# EAGLE design utophuile_shield_v0_2 (EAGLE 5.07)
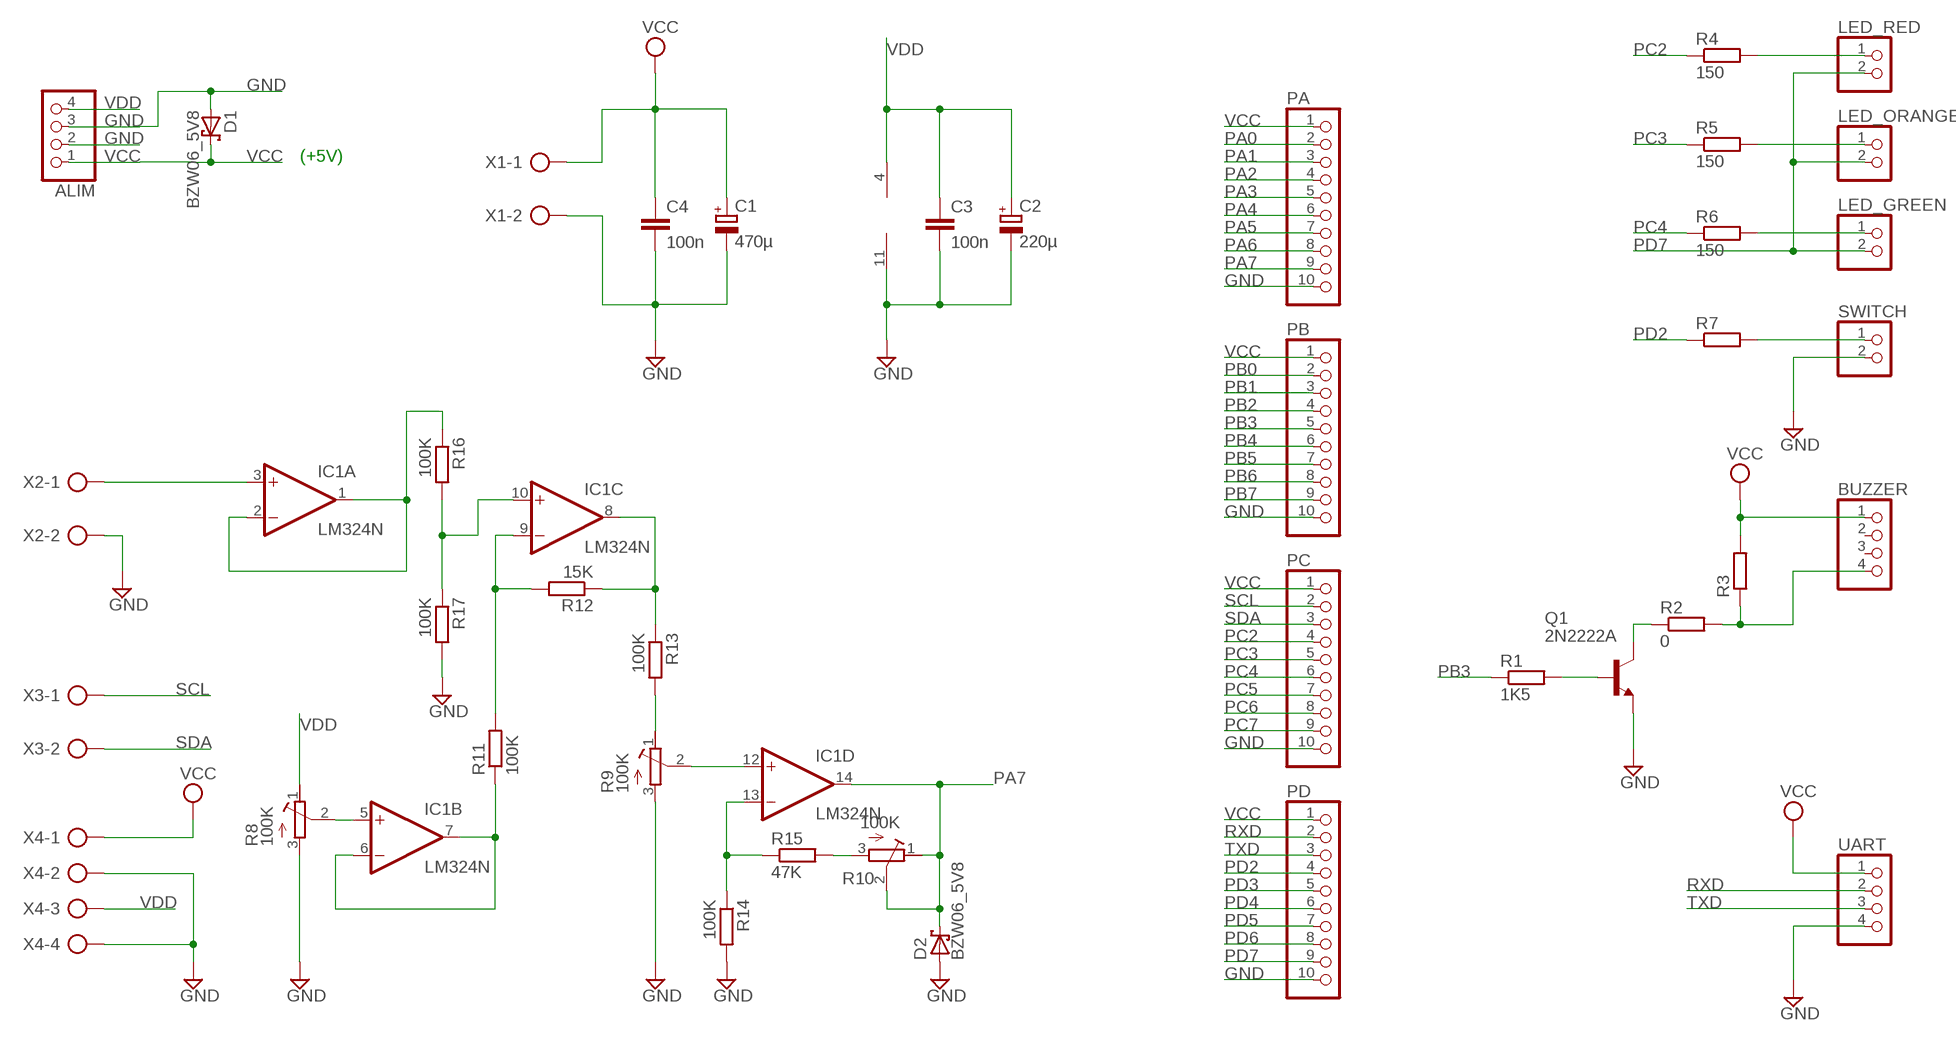
[diagram p0: schematic, sheet 1]

## Parts
ALIM  PINHD-1X4  [1X04]
BUZZER  PINHD-1X4_2.54-90°  [1X04/90]
C1  470µ  CPOL-EUE3.5-10  [E3,5-10]
C2  220µ  CPOL-EUE3.5-10  [E3,5-10]
C3  100n  C-EU050-025X075  [C050-025X075]
C4  100n  C-EU050-025X075  [C050-025X075]
D1  BZW06_5V8  BZW04XX  [F126Z12]
D2  BZW06_5V8  BZW04XX  [F126Z12]
IC1  LM324N  [DIL14]
LED_GREEN  PINHD-1X2_2.54-90°  [1X02/90]
LED_ORANGE  PINHD-1X2_2.54-90°  [1X02/90]
LED_RED  PINHD-1X2_2.54-90°  [1X02/90]
PA  PINHD-1X10  [1X10]
PB  PINHD-1X10  [1X10]
PC  PINHD-1X10  [1X10]
PD  PINHD-1X10  [1X10]
Q1  2N2222A  [TO18]
R1  1K5  R-EU_0207/10  [0207/10]
R2  0  R-EU_0207/10  [0207/10]
R3  R-EU_0207/10  [0207/10]
R4  150  R-EU_0207/10  [0207/10]
R5  150  R-EU_0207/10  [0207/10]
R6  150  R-EU_0207/10  [0207/10]
R7  R-EU_0207/10  [0207/10]
R8  100K  R-TRIMMT93YB  [RTRIMT93YB]
R9  100K  R-TRIMMT93YB  [RTRIMT93YB]
R10  100K  R-TRIMMT93YB  [RTRIMT93YB]
R11  100K  R-EU_0207/10  [0207/10]
R12  15K  R-EU_0207/10  [0207/10]
R13  100K  R-EU_0207/10  [0207/10]
R14  100K  R-EU_0207/10  [0207/10]
R15  47K  R-EU_0207/10  [0207/10]
R16  100K  R-EU_0207/10  [0207/10]
R17  100K  R-EU_0207/10  [0207/10]
SWITCH  PINHD-1X2_2.54-90°  [1X02/90]
UART  PINHD-1X4_2.54-90°  [1X04/90]
X1  AK500/2  [AK500/2]
X2  AK500/2  [AK500/2]
X3  AK500/2  [AK500/2]
X4  AK500/4  [AK500/4]

## Nets
GND: ALIM.2 ALIM.3 C1.- C2.- C3.2 C4.2 D1.A D2.A IC1.11(P:V-) PA.10 PB.10 PC.10 PD.10 Q1.1(E) R8.3(E) R9.3(E) R14.2 R17.2 SWITCH.2 UART.4 X1.2 X2.2 X4.2 X4.4
N$1: IC1.3(A:+IN) X2.1
N$2: R7.2 SWITCH.1
N$3: LED_GREEN.1 R6.2
N$4: LED_ORANGE.1 R5.2
N$5: LED_RED.1 R4.2
N$6: IC1.6(B:-IN) IC1.7(B:OUT) R11.1
N$7: BUZZER.4 R2.2 R3.1
N$8: Q1.3(C) R2.1
N$9: IC1.5(B:+IN) R8.2(S)
N$10: Q1.2(B) R1.2
N$11: IC1.9(C:-IN) R11.2 R12.2
N$12: IC1.8(C:OUT) R12.1 R13.1
N$13: R9.1(A) R13.2
N$14: IC1.12(D:+IN) R9.2(S)
N$15: IC1.13(D:-IN) R14.1 R15.1
N$16: R10.3(E) R15.2
N$17: IC1.10(C:+IN) R16.2 R17.1
N$18: IC1.1(A:OUT) IC1.2(A:-IN) R16.1
PA0: PA.2
PA1: PA.3
PA2: PA.4
PA3: PA.5
PA4: PA.6
PA5: PA.7
PA6: PA.8
PA7: D2.C IC1.14(D:OUT) PA.9 R10.1(A) R10.2(S)
PB0: PB.2
PB1: PB.3
PB2: PB.4
PB3: PB.5 R1.1
PB4: PB.6
PB5: PB.7
PB6: PB.8
PB7: PB.9
PC2: PC.4 R4.1
PC3: PC.5 R5.1
PC4: PC.6 R6.1
PC5: PC.7
PC6: PC.8
PC7: PC.9
PD2: PD.4 R7.1
PD3: PD.5
PD4: PD.6
PD5: PD.7
PD6: PD.8
PD7: LED_GREEN.2 LED_ORANGE.2 LED_RED.2 PD.9
RXD: PD.2 UART.2
SCL: PC.2 X3.1
SDA: PC.3 X3.2
TXD: PD.3 UART.3
VCC: ALIM.1 BUZZER.1 C1.+ C4.1 D1.C PA.1 PB.1 PC.1 PD.1 R3.2 UART.1 X1.1 X4.1
VDD: ALIM.4 C2.+ C3.1 IC1.4(P:V+) R8.1(A) X4.3
Unconnected: BUZZER.2 BUZZER.3

## Notes on the sheet
- (+5V)

## Library data of the parts
ALIM = pinhead:PINHD-1X4: PIN HEADER
BUZZER UART = pinhead-1:PINHD-1X4: PIN HEADER
C1 C2 = rcl:CPOL-EU: POLARIZED CAPACITOR, European symbol
C3 C4 = rcl:C-EU: CAPACITOR, European symbol
D1 D2 = diode:BZW04XX: DIODE
IC1 = linear:LM324: OP AMP
LED_GREEN LED_ORANGE LED_RED SWITCH = pinhead-1:PINHD-1X2: PIN HEADER
PA PB PC PD = pinhead:PINHD-1X10: PIN HEADER
Q1 = transistor-npn:2N2222*: NPN Transistor
R1-R7 R11-R17 = rcl:R-EU_: RESISTOR, European symbol
R8-R10 = rcl:R-TRIMM: Trimm resistor
X1-X3 = con-ptr500:AK500/2: CONNECTOR
X4 = con-ptr500:AK500/4: CONNECTOR

## Board
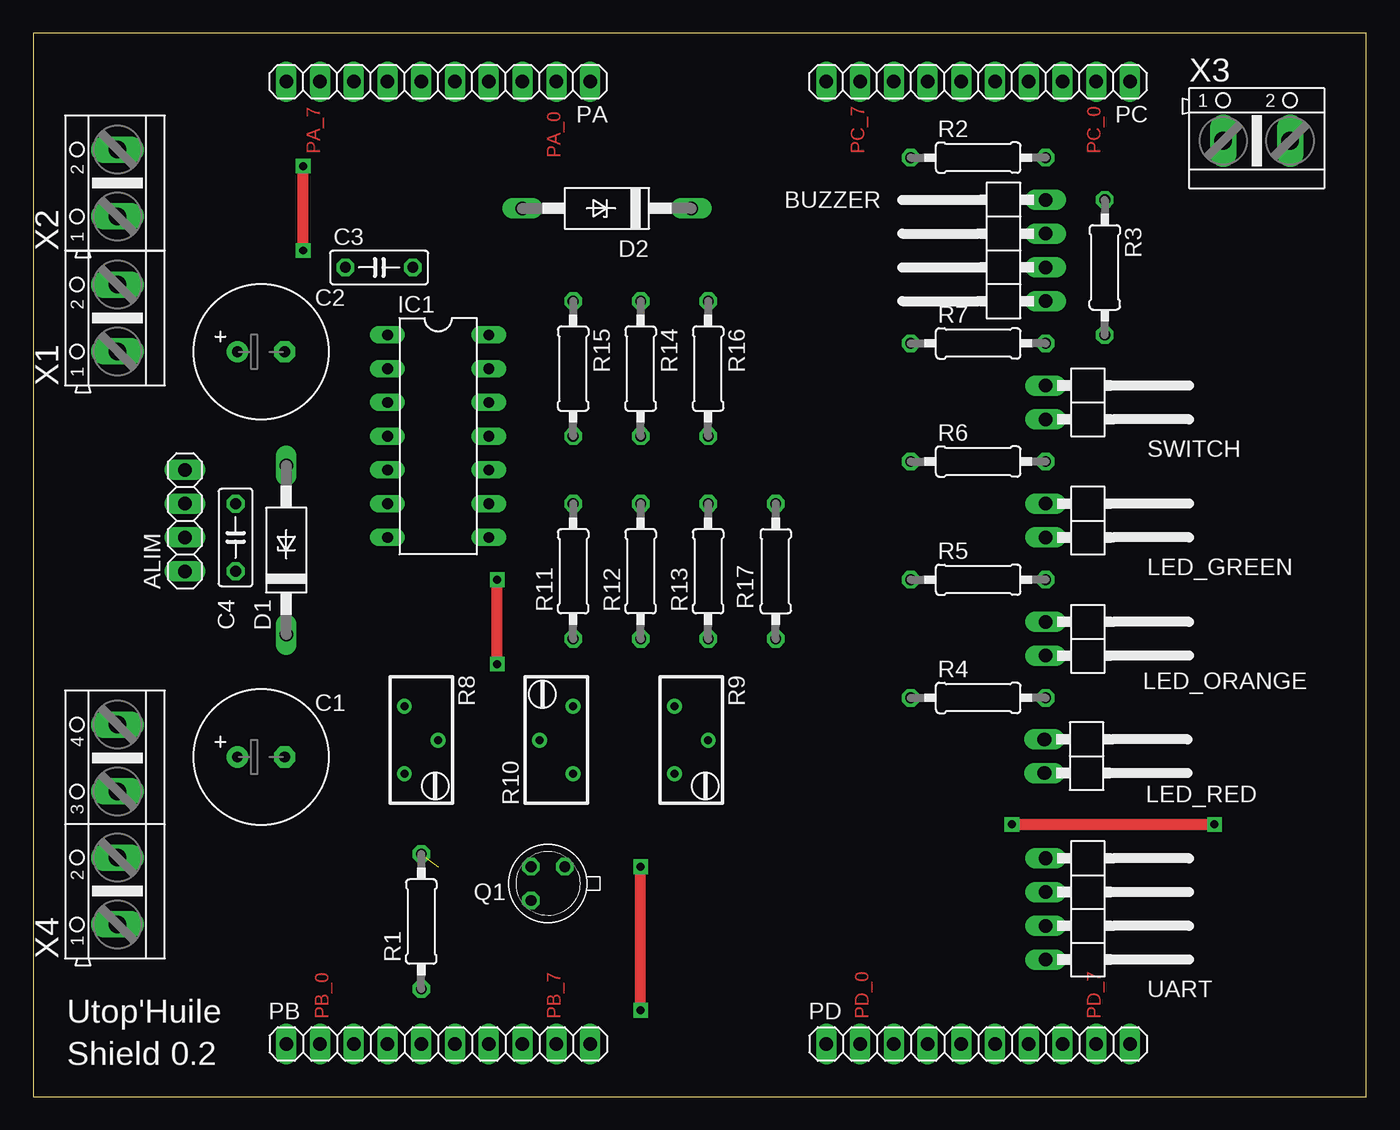
[diagram p1: board, top side]
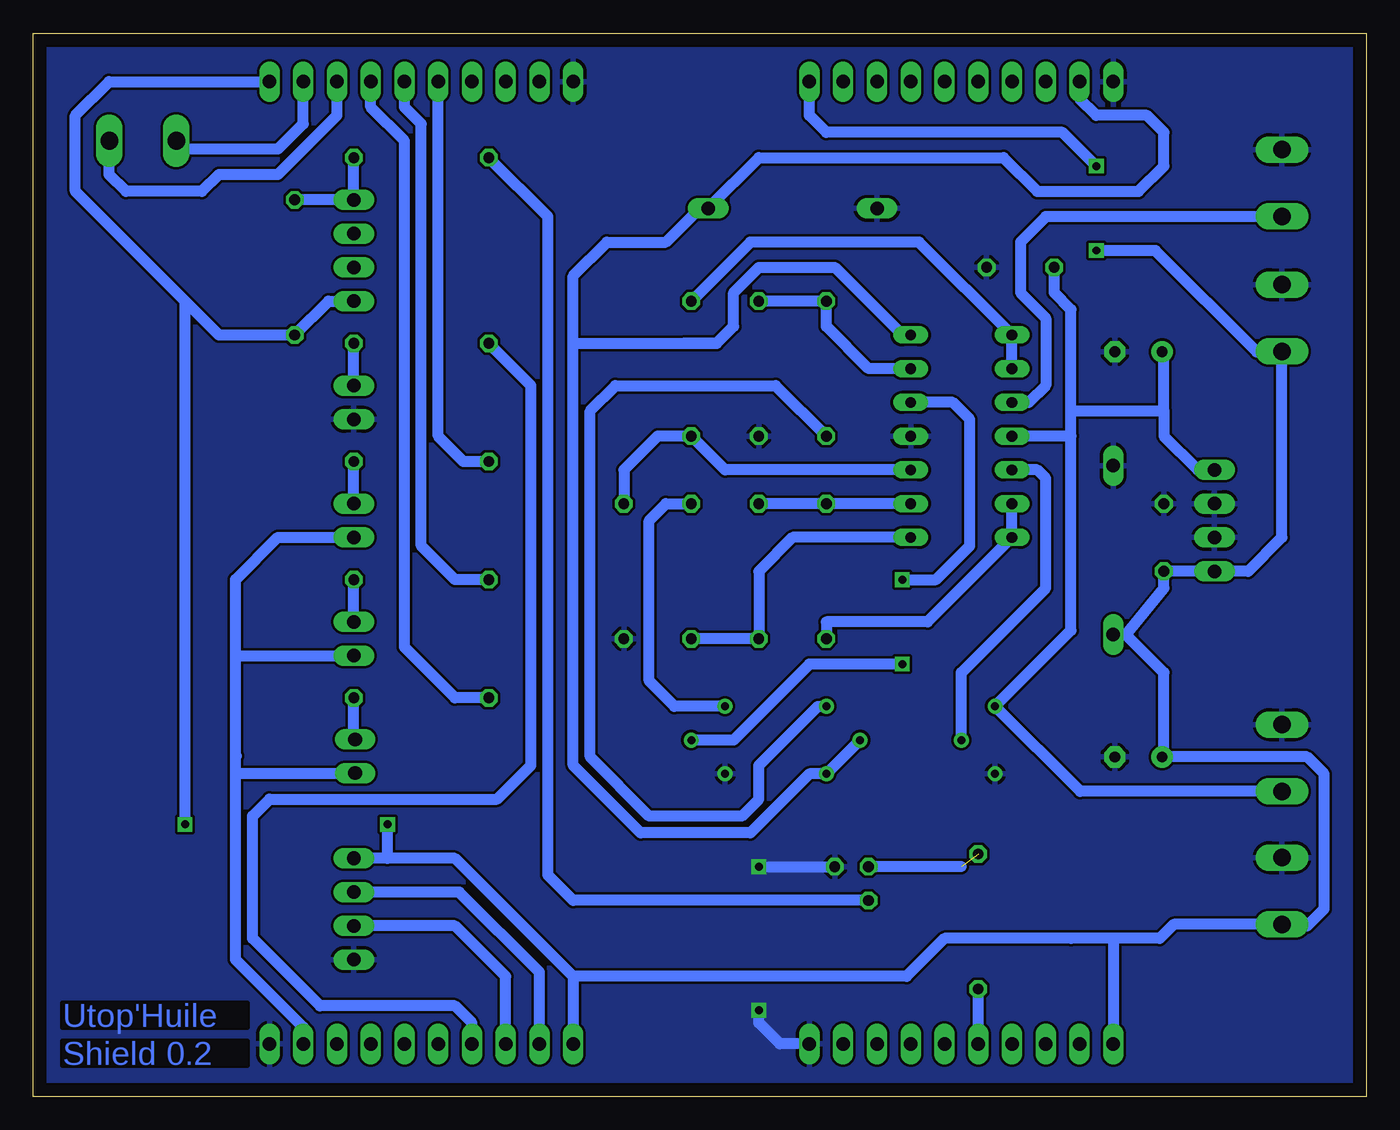
[diagram p2: board, bottom side, seen from below]

Size 100.32 x 80 mm. Coordinates in mm from the lower left corner, seen from the top.
Outline: 100.32,0 100.32,80 0,80 0,0 100.32,0
Copper layers (1*16): Top 0.035mm / dielectric 1.5mm / Bottom 0.035mm
Design rules "default *": minimum track width 10mil, minimum drill 24mil, track to track 8mil, track to pad 8mil, pad to pad 8mil, via to via 8mil, smd to smd 8mil, copper to edge 40mil, drill to drill 8mil, minimum pad ring 10mil, minimum via ring 10mil, stop-mask expansion 4mil, vias tented up to drill 0mil, thermal gap 10mil
Milling: 8 lines

### Footprints (pad centres in the part's own frame; a part is rotated, then mirrored left to right if it is on the bottom)
1X04 = drill 1.016 long: 1 -3.81,0; 2 -1.27,0; 3 1.27,0; 4 3.81,0
1X04/90 = drill 1.016 long: 1 -3.81,-3.81; 2 -1.27,-3.81; 3 1.27,-3.81; 4 3.81,-3.81
E3,5-10 = drill 0.813 pad 1.6 round: + -1.778,0 | drill 0.813 pad 1.6 octagon: - 1.778,0
C050-025X075 = drill 0.813 octagon: 1 -2.54,0; 2 2.54,0
F126Z12 = drill 1.016 long: A 6.35,0; C -6.35,0
DIL14 = drill 0.813 long: 1 -7.62,-3.81; 2 -5.08,-3.81; 3 -2.54,-3.81; 4 0,-3.81; 5 2.54,-3.81; 6 5.08,-3.81; 7 7.62,-3.81; 8 7.62,3.81; 9 5.08,3.81; 10 2.54,3.81; 11 0,3.81; 12 -2.54,3.81; 13 -5.08,3.81; 14 -7.62,3.81
1X02/90 = drill 1.016 long: 1 -2.54,-3.81; 2 0,-3.81
1X10 = drill 1.016 long: 1 -11.43,0; 2 -8.89,0; 3 -6.35,0; 4 -3.81,0; 5 -1.27,0; 6 1.27,0; 7 3.81,0; 8 6.35,0; 9 8.89,0; 10 11.43,0
TO18 = drill 0.813 octagon: 1 -1.27,-1.27; 2 1.27,-1.27; 3 1.27,1.27
0207/10 = drill 0.813 octagon: 1 -5.08,0; 2 5.08,0
RTRIMT93YB = drill 0.61 round: 1 1.27,-2.54; 2 -1.27,0; 3 1.27,2.54
AK500/2 = drill 1.321 long: 1 -2.515,0; 2 2.515,0
AK500/4 = drill 1.321 long: 1 -7.518,0; 2 -2.489,0; 3 2.489,0; 4 7.518,0

### Placement (x,y rotation side)
ALIM  11.42,43.33 90 top
BUZZER  72.39,63.65 90 top
C1  17.14,25.55 0 top
C2  17.14,56.03 0 top
C3  26.03,62.38 0 top
C4  15.23,42.06 90 top
D1  19.05,41.11 90 top
D2  43.17,66.83 180 top
IC1  30.48,49.68 270 top
LED_GREEN  80.01,42.06 270 top
LED_ORANGE  80.01,33.17 270 top
LED_RED  79.91,24.34 270 top
PA  30.48,76.35 180 top
PB  30.48,3.96 0 top
PC  71.12,76.35 180 top
PD  71.12,3.96 0 top
Q1  38.73,16.03 180 top
R1  29.21,13.17 90 top
R2  71.12,70.64 0 top
R3  80.64,62.38 270 top
R4  71.12,30 0 top
R5  71.12,38.89 0 top
R6  71.12,47.78 0 top
R7  71.12,56.67 0 top
R8  29.21,26.82 180 top
R9  49.52,26.82 180 top
R10  39.36,26.82 0 top
R11  40.63,39.52 90 top
R12  45.71,39.52 90 top
R13  50.79,39.52 90 top
R14  45.71,54.76 270 top
R15  40.63,54.76 270 top
R16  50.79,54.76 270 top
R17  55.88,39.52 270 top
SWITCH  80.01,50.95 270 top
UART  80.01,14.12 270 top
X1  6.34,58.57 90 top
X2  6.34,68.73 90 top
X3  92.07,71.91 0 top
X4  6.34,20.47 90 top

### Tracks (layer width: path | path; a pad name or v marks a point on that pad's centre or on a via)
GND  (via drill 0.6)
  Top 0.813: v45.71,6.5 v45.71,17.3
  Bottom 0.813: v45.71,17.3 Q1.1 | PB.10 44.13,3.96 45.71,5.55 v45.71,6.5
  pour Bottom (isolate 0.1): 0.63,0.79 0.63,79.53 99.69,79.53 99.69,0.79
N$1
  Bottom 0.813: IC1.3 25.39,52.22 24.12,53.49 24.12,58.57 26.03,60.48 26.03,64.29 24.12,66.19 17.78,66.19 | 17.78,66.19 6.37,66.19 X2.1 | 17.78,66.19 18.41,66.19
N$2
  Bottom 0.813: SWITCH.1 R7.2
N$3
  Bottom 0.813: LED_GREEN.1 R6.2
N$4
  Bottom 0.813: LED_ORANGE.1 R5.2
N$5
  Bottom 0.813: R4.2 76.2,26.98 LED_RED.1
N$6
  Bottom 0.813: R11.1 40.63,35.71 33.02,35.71 IC1.7 IC1.6
N$7
  Bottom 0.813: BUZZER.4 R2.2 | BUZZER.4 77.47,67.46 | BUZZER.4 R3.1
N$8
  Bottom 0.813: R2.1 61.59,66.19 61.59,16.66 59.68,14.76 Q1.3
N$9
  Bottom 0.813: R8.2 30.48,31.9 24.12,38.25 24.12,46.51 24.76,47.14 IC1.5
N$10  (1 unrouted)
  Bottom 0.813: 30.48,17.3 Q1.2
N$11
  Bottom 0.813: IC1.9 R11.2 R12.2
N$12
  Bottom 0.813: R13.1 R12.1 45.71,39.52 43.17,42.06 IC1.8
N$13
  Bottom 0.813: R13.2 52.7,44.6 53.97,43.33 53.97,31.27 52.06,29.36 R9.1
N$14  (via drill 0.6)
  Top 0.813: v34.92,32.54 v34.92,38.89
  Bottom 0.813: R9.2 47.62,26.82 41.9,32.54 v34.92,32.54 | v34.92,38.89 32.38,38.89 29.84,41.43 29.84,50.95 31.11,52.22 IC1.12
N$15
  Bottom 0.813: IC1.13 37.46,54.76 40.63,57.94 R15.1 R14.1
N$16
  Bottom 0.813: R10.3 41.27,29.36 45.71,24.92 45.71,22.38 46.98,21.11 53.97,21.11 58.41,25.55 58.41,51.59 56.51,53.49 44.45,53.49 R15.2
N$17
  Bottom 0.813: IC1.10 48.25,47.14 R16.2 53.34,49.68 55.88,47.14 R17.1
N$18
  Bottom 0.813: R16.1 46.35,64.29 33.65,64.29 IC1.1 IC1.2
PA7
  Bottom 0.813: IC1.14 34.92,57.3 40,62.38 45.71,62.38 47.62,60.48 47.62,57.94 48.89,56.67 | 48.89,56.67 51.43,56.67 | 59.68,56.67 59.68,24.92 54.6,19.84 46.35,19.84 41.9,24.28 R10.1 R10.2 | 59.68,56.67 59.68,61.75 57.14,64.29 52.7,64.29 50.16,66.83 D2.C 45.71,70.64 27.3,70.64 24.76,68.1 17.14,68.1 15.23,70 15.23,72.54 16.51,73.81 20.32,73.81 21.59,75.08 PA.9 | 59.68,56.67 48.89,56.67
PB3
  Bottom 0.813: PB.5 R1.1
PC2
  Bottom 0.813: PC.4 74.93,74.45 72.39,71.91 72.39,33.81 68.58,30 R4.1
PC3
  Bottom 0.813: PC.5 72.39,74.45 71.12,73.18 71.12,41.43 68.58,38.89 R5.1
PC4
  Bottom 0.813: PC.6 69.84,49.68 67.94,47.78 R6.1
PD2
  Bottom 0.813: R7.1 62.86,53.49 62.86,24.92 65.4,22.38 82.55,22.38 83.81,21.11 83.81,11.9 78.73,6.82 68.58,6.82 67.31,5.55 PD.4
PD7
  Bottom 0.813: 85.09,25.55 85.09,33.17 | PD.9 80.01,5.23 85.09,10.31 85.09,24.28 | 85.09,24.28 85.09,25.55 | 85.09,25.55 85.03,25.61 | LED_GREEN.2 81.91,42.06 85.09,38.89 85.09,33.17 | 85.09,33.17 LED_ORANGE.2 | LED_RED.2 85.03,24.34 85.09,24.28
RXD
  Bottom 0.813: PD.2 62.22,9.04 62.22,9.36 68.26,15.39 UART.2
SCL
  Bottom 0.813: PC.2 80.01,73.18 81.91,71.27 88.92,71.27 X3.1
SDA
  Bottom 0.813: PC.3 77.47,73.81 81.91,69.37 86.36,69.37 87.62,68.1 93.34,68.1 94.61,69.37 94.61,71.88 X3.2
TXD
  Bottom 0.813: UART.3 68.58,12.85 67.94,12.22 64.77,9.04 PD.3
VCC  (via drill 0.6)
  Top 0.813: v20.32,63.65 v20.32,70 | v73.66,20.47 v88.9,20.47
  Bottom 0.813: 73.66,17.93 68.58,17.93 59.68,9.04 | 73.66,17.93 UART.1 | 59.68,9.04 59.68,8.41 | 6.98,12.95 X4.1 | 6.98,12.95 14.5,12.95 15.55,11.9 19.05,11.9 | 59.68,8.41 PD.1 | 18.09,34.76 D1.C | 18.09,34.76 15.23,38.25 C4.1 ALIM.1 8.88,39.52 6.34,42.06 X1.1 6.37,56.03 8.25,56.03 15.87,63.65 v20.32,63.65 | 18.09,34.76 15.23,31.9 15.23,25.68 C1.+ 4.44,25.55 3.17,24.28 3.17,14.12 4.44,12.85 6.88,12.85 6.98,12.95 | 88.9,59.84 97.15,68.1 97.15,73.81 94.61,76.35 PC.1 | 75.56,59.84 BUZZER.1 78.1,59.84 R3.2 86.36,57.3 88.9,59.84 | PA.1 41.9,73.81 40.63,72.54 22.86,72.54 v20.32,70 | v88.9,20.47 88.9,59.84 | 73.66,17.93 v73.66,20.47 | 59.68,9.04 59.68,8.41 | 59.68,9.04 34.6,9.04 31.75,11.9 22.22,11.9 19.05,11.9 | 19.05,11.9 PB.1
VDD
  Bottom 0.813: 15.23,51.59 15.23,55.91 C2.+ | C3.1 23.49,60.48 22.22,59.21 22.22,51.59 | 22.22,49.68 22.22,35.08 R8.1 21.53,22.96 X4.3 | 22.22,49.68 22.22,51.59 | 22.22,49.68 IC1.4 | 15.23,51.59 15.23,49.68 12.69,47.14 ALIM.4 | 22.22,51.59 15.23,51.59

### Text on the board
Top: PA_7 | PC_7 | PC_0 | PA_0 | PB_0 | PB_7 | PD_0 | PD_7
Bottom: Utop'Huile | Shield 0.2
tNames: Utop'Huile | Shield 0.2
tDocu: SCL | SDA | GND | VE | GND | +5V | GND | GND | +12V | GND | +5V | RXD | TXD | +5V | GND